# Altium schematic sheet Принципиальная схема.SchDoc: Преобразователь
size 420 x 297 mm; CheckedBy: Эпштейн Л.Б.; Author: Гусев И.С.; CompanyName: ИЯФ СО РАН; DrawnBy: 32; Address1: Address1; Address2: Address2; Address3: Address3; Address4: Address4; DocumentNumber: АБВГ.123456.001 Э3; Revision: 0; SheetNumber: 1; SheetTotal: 1; Scale: 1:1; Letter1Column: 1; DocumentType: Схема электрическая принципиальная; FirstReferrence: АБВГ.123456.001; DocumentName: 12; Rule: PcbType=ProtelPcb
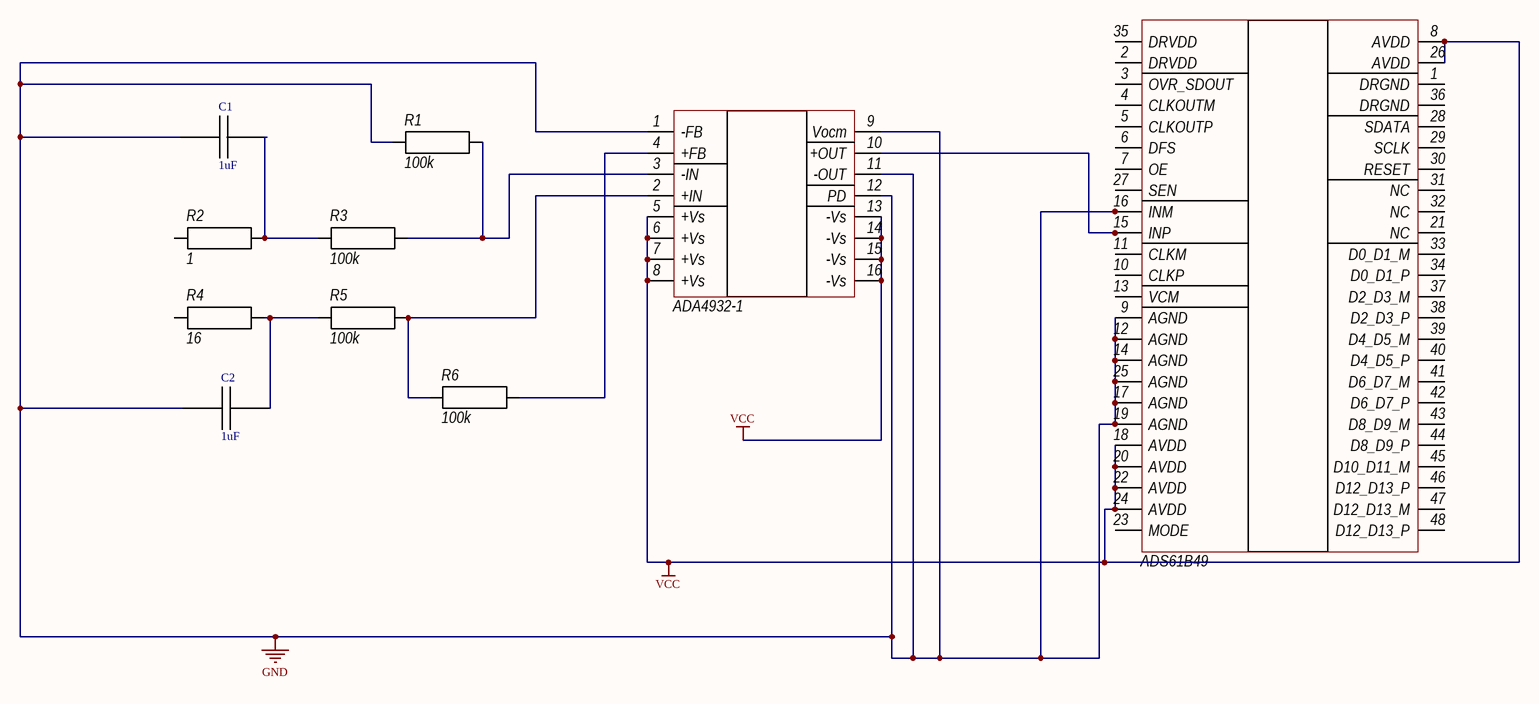
[diagram p0: Принципиальная схема.SchDoc]

## Parts
ADA4932-1  ADA4932-1  [CP-16-2]  (value not drawn)
ADS61B49  ADS61B49  [VQFN-48]  (value not drawn)
C1  1uF  [Capasitor10X23]
C2  1uF  [Capasitor10X23]
R1  100k  [SMD 0402]
R2  1  [SMD 0402]
R3  100k  [SMD 0402]
R4  16  [SMD 0402]
R5  100k  [SMD 0402]
R6  100k  [SMD 0402]

## Nets
GND: ADA4932-1.1(-FB) ADA4932-1.9(Vocm) ADA4932-1.11(-OUT) ADA4932-1.12(PD) ADS61B49.9(AGND) ADS61B49.12(AGND) ADS61B49.14(AGND) ADS61B49.16(INM) ADS61B49.17(AGND) ADS61B49.19(AGND) ADS61B49.25(AGND) C1.2 C2.2 R1.1
VCC: ADA4932-1.5(+Vs) ADA4932-1.6(+Vs) ADA4932-1.7(+Vs) ADA4932-1.8(+Vs) ADA4932-1.13(-Vs) ADA4932-1.14(-Vs) ADA4932-1.15(-Vs) ADA4932-1.16(-Vs) ADS61B49.8(AVDD) ADS61B49.18(AVDD) ADS61B49.20(AVDD) ADS61B49.22(AVDD) ADS61B49.24(AVDD) ADS61B49.26(AVDD)
NetADA4932-1_2: ADA4932-1.2(+IN) R5.2 R6.1
NetADA4932-1_3: ADA4932-1.3(-IN) R1.2 R3.2
NetADA4932-1_4: ADA4932-1.4(+FB) R6.2
NetADA4932-1_10: ADA4932-1.10(+OUT) ADS61B49.15(INP)
NetC1_1: C1.1 R2.2 R3.1
NetC2_1: C2.1 R4.2 R5.1

Not connected (* = marked no-connect by the designer): ADS61B49 1(DRGND) 2(DRVDD) 3(OVR_SDOUT) 4(CLKOUTM) 5(CLKOUTP) 6(DFS) 7(OE) 10(CLKP) 11(CLKM) 13(VCM) 21(NC) 23(MODE) 27(SEN) 28(SDATA) 29(SCLK) 30(RESET) 31(NC) 32(NC) 33(D0_D1_M) 34(D0_D1_P) 35(DRVDD) 36(DRGND) 37(D2_D3_M) 38(D2_D3_P) 39(D4_D5_M) 40(D4_D5_P) 41(D6_D7_M) 42(D6_D7_P) 43(D8_D9_M) 44(D8_D9_P) 45(D10_D11_M) 46(D12_D13_P) 47(D12_D13_M) 48(D12_D13_P); R2 1; R4 1

## Notes on the sheet
- Перв. примен.
- Справ. №
- Подп. и дата
- Инв. № дубл.
- Взам. инв. №
- Разраб.
- Изм.
- Лист
- № докум.
- Подп.
- Дата
- Лит.
- Масса
- Масштаб
- Пров.
- Т.контр.
- Листов
- Инв. № подл.
- Утв.
- Н.контр.
- 2.106-A3
- Копировал
- Формат А3

## Library data of the parts
C1 C2 = Capasitor: Value: 1uF
R1-R6 = Resistor
  R1 R3 R5 R6: Value: 100k
  R2: Value: 1
  R4: Value: 16